# EAGLE schematic rev4.1 (EAGLE 7.5.0)

## Sheet 1 of 3
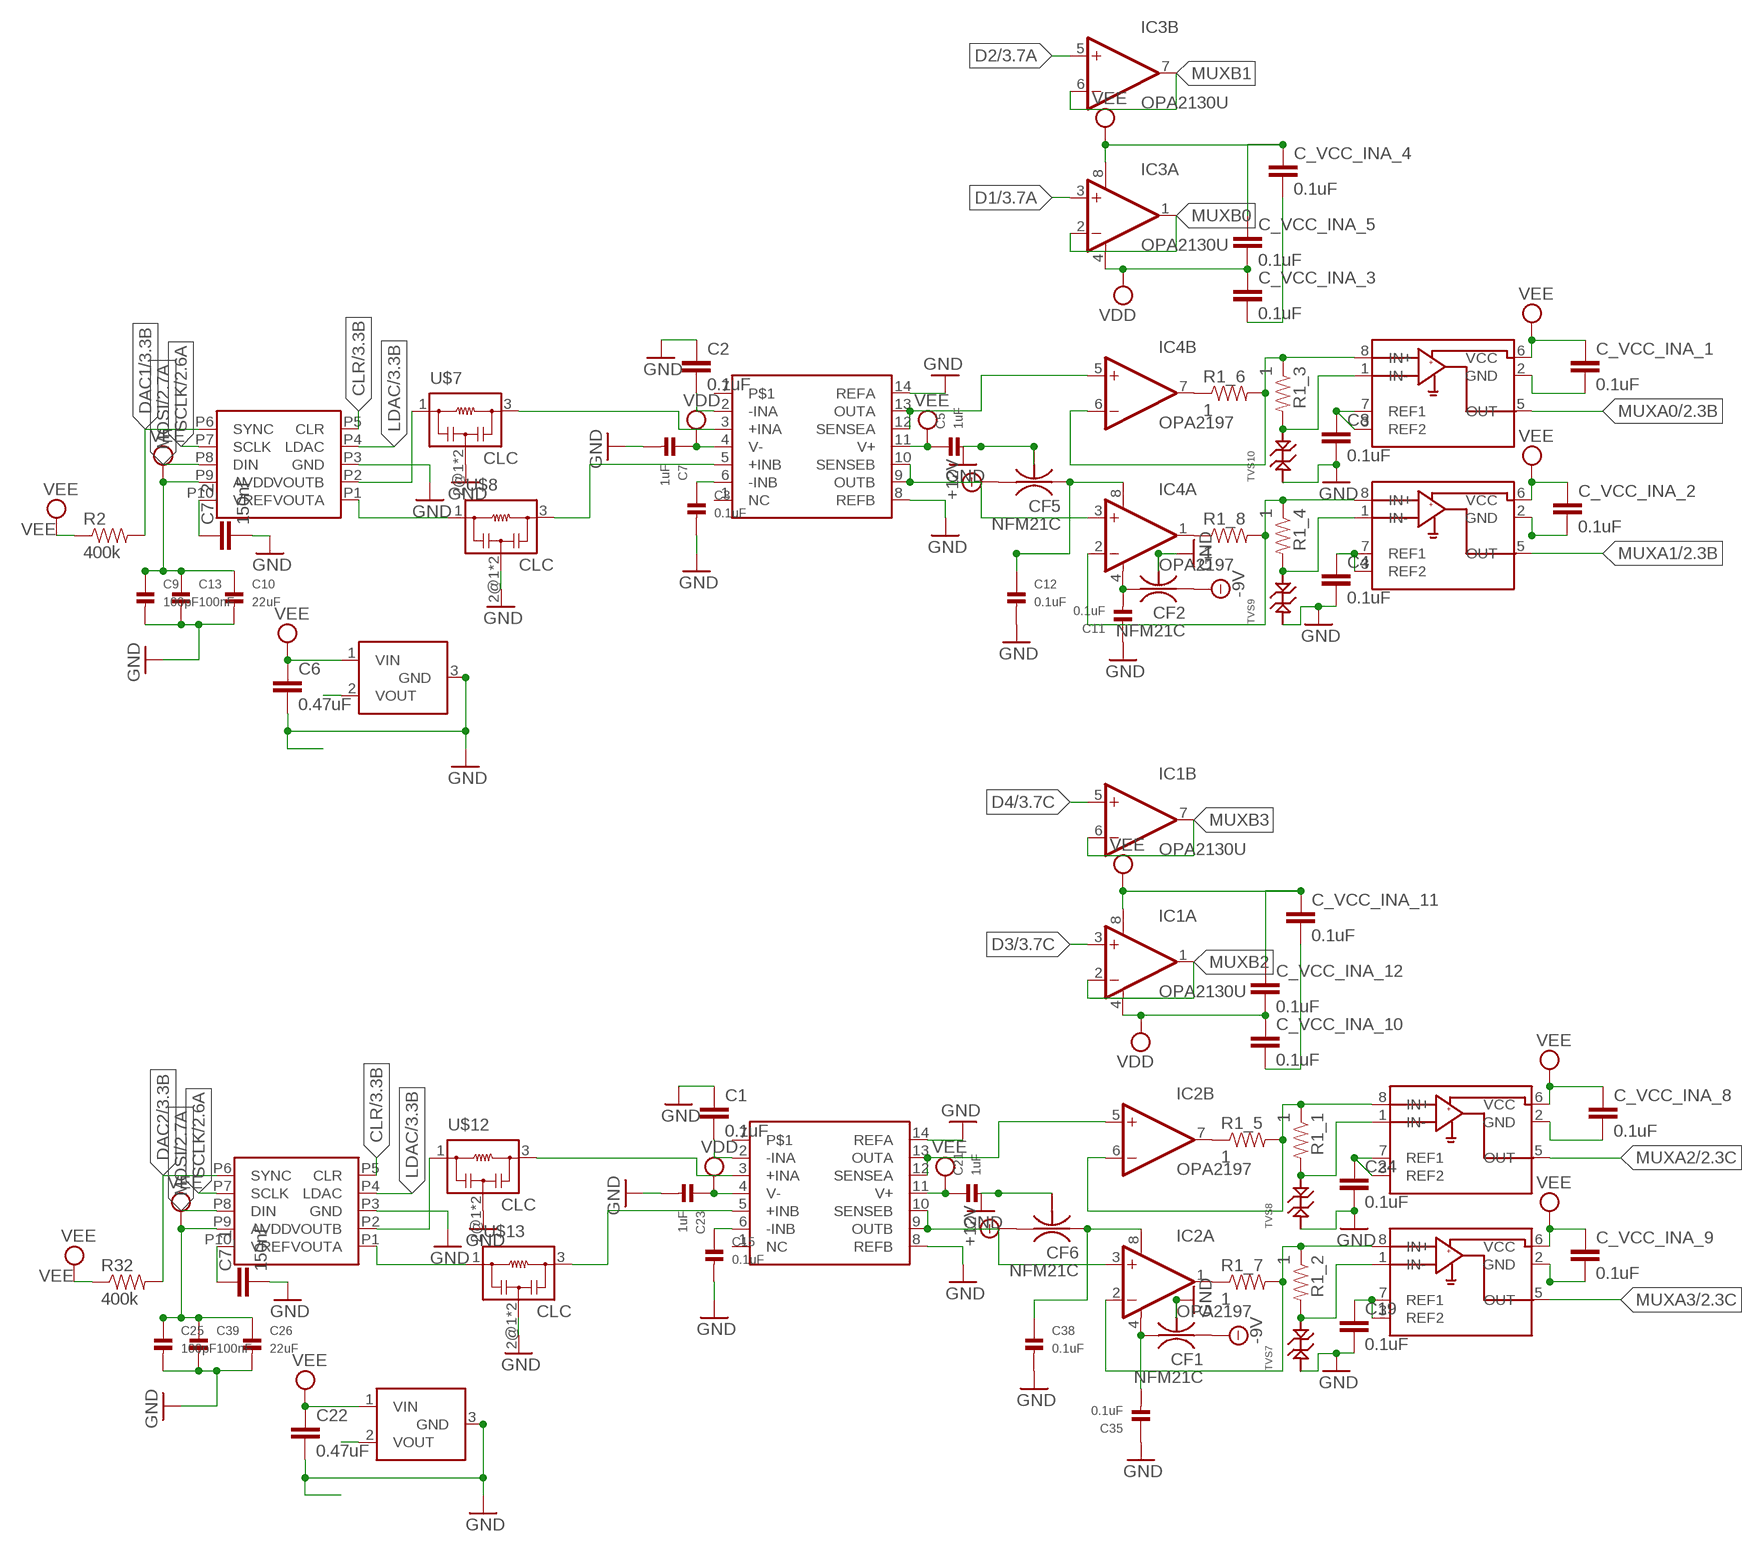
[diagram p0: schematic, sheet 1, part 1 of 2]
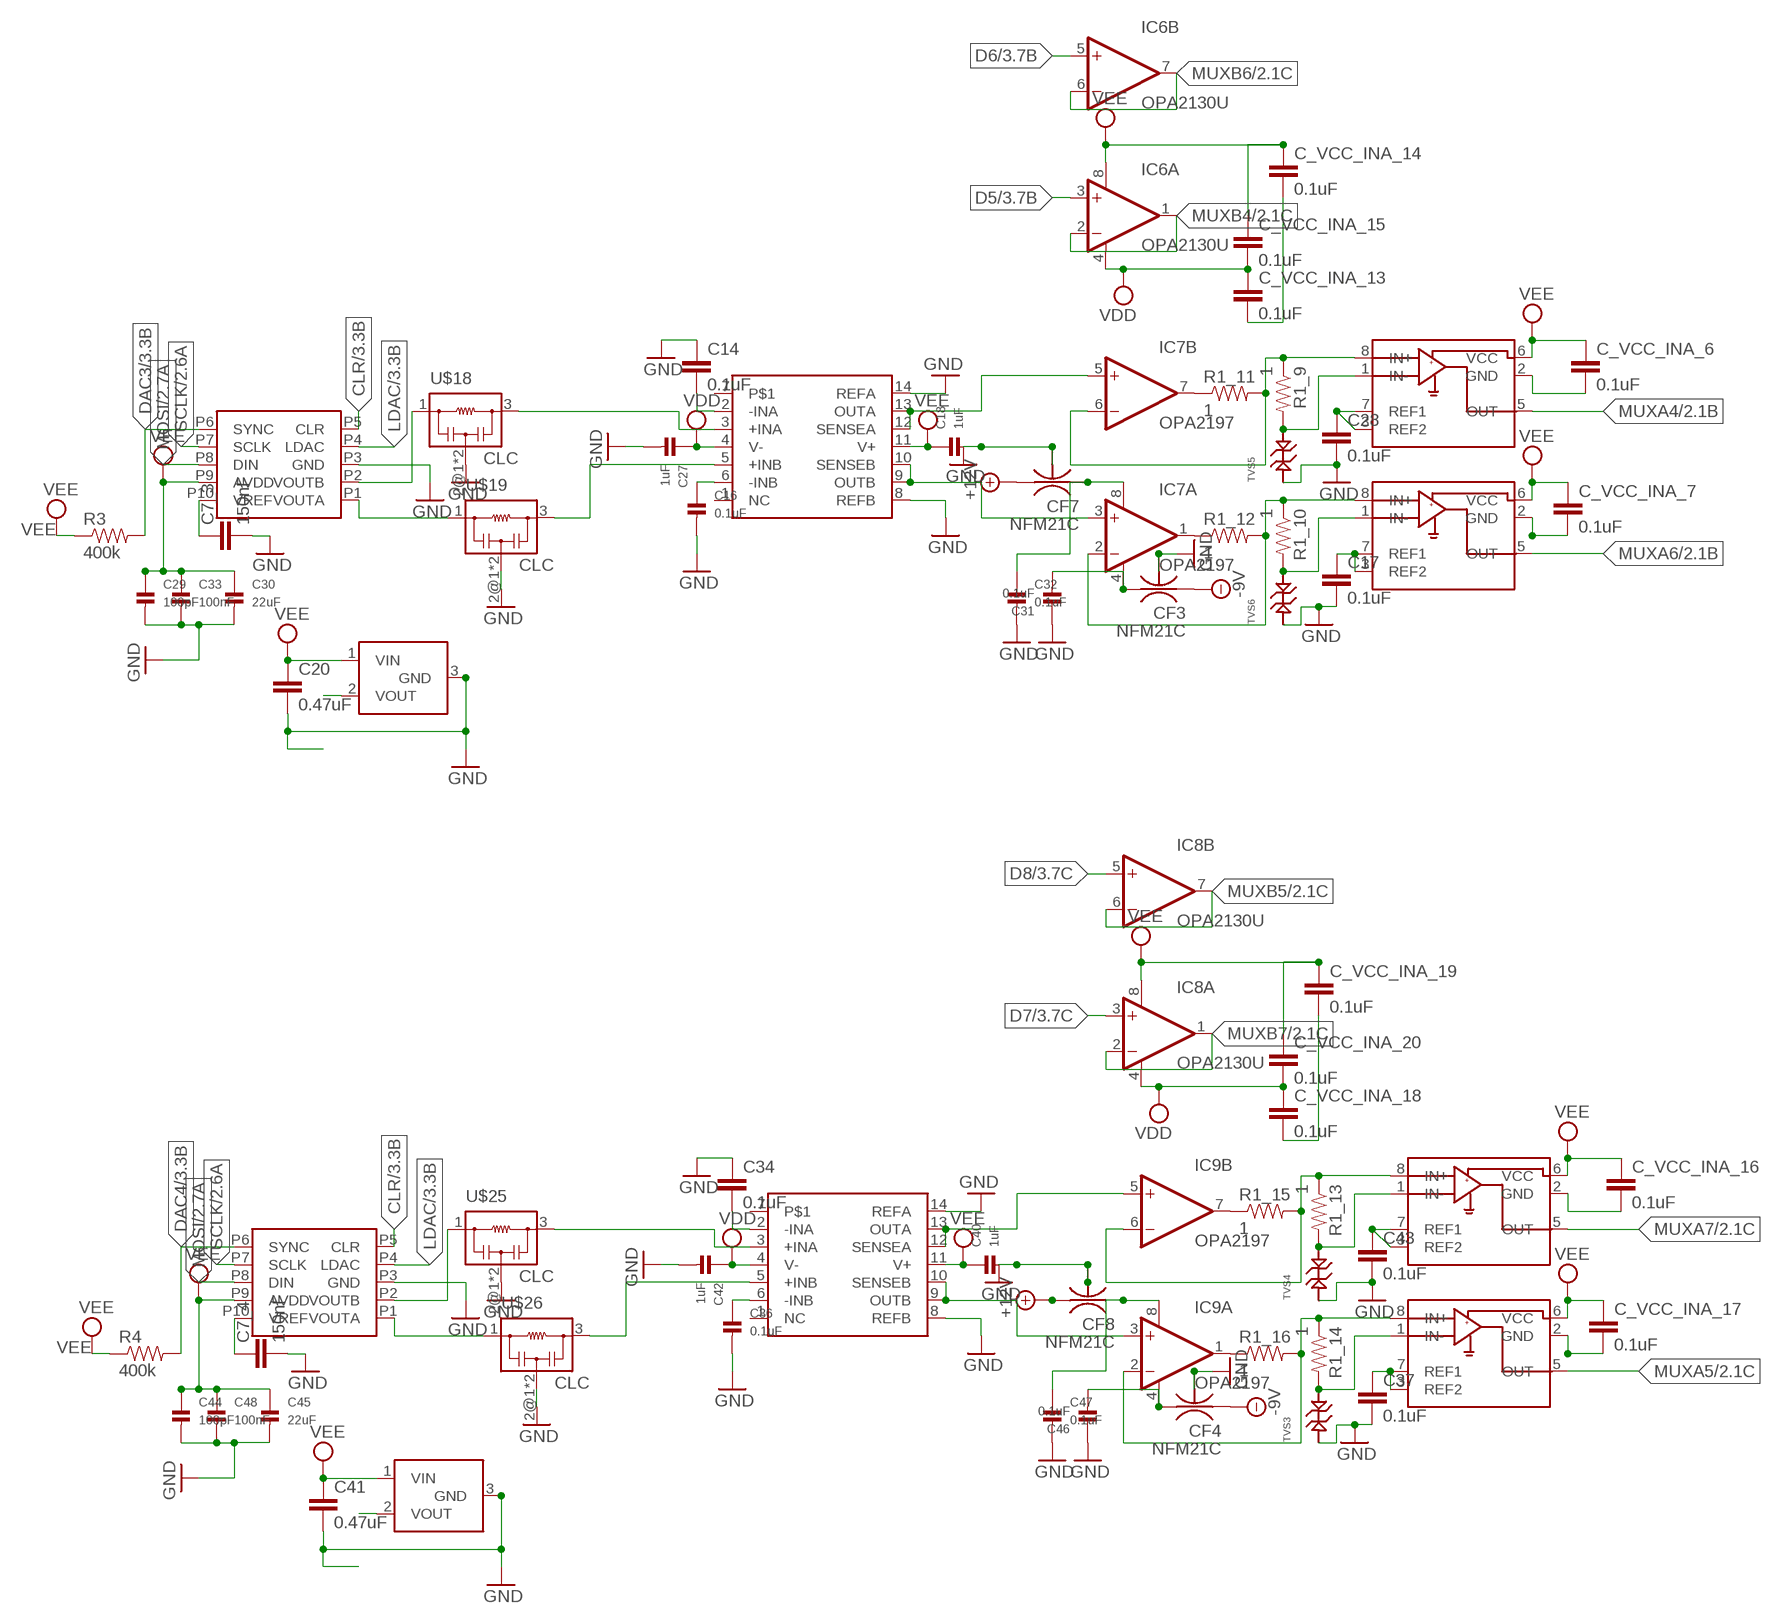
[diagram p1: schematic, sheet 1, part 2 of 2]

### Parts
C1  0.1uF  CAP0402-CAP  [0402-CAP]
C2  0.1uF  CAP0402-CAP  [0402-CAP]
C3  0.1uF  CAP_CERAMIC0402  [0402]
C4  0.1uF  CAP0402-CAP  [0402-CAP]
C5  1uF  CAP_CERAMIC0402  [0402]
C6  0.47uF  CAP0402-CAP  [0402-CAP]
C7  1uF  CAP_CERAMIC0402  [0402]
C7_1  150nF  CAP0402-CAP  [0402-CAP]
C7_2  150nF  CAP0402-CAP  [0402-CAP]
C7_3  150nF  CAP0402-CAP  [0402-CAP]
C7_4  150nF  CAP0402-CAP  [0402-CAP]
C8  0.1uF  CAP0402-CAP  [0402-CAP]
C9  100pF  CAP_CERAMIC0402  [0402]
C10  22uF  CAP_CERAMIC0805  [0805]
C11  0.1uF  CAP_CERAMIC0402  [0402]
C12  0.1uF  CAP_CERAMIC0402  [0402]
C13  100nF  CAP_CERAMIC0402  [0402]
C14  0.1uF  CAP0402-CAP  [0402-CAP]
C15  0.1uF  CAP_CERAMIC0402  [0402]
C16  0.1uF  CAP_CERAMIC0402  [0402]
C17  0.1uF  CAP0402-CAP  [0402-CAP]
C18  1uF  CAP_CERAMIC0402  [0402]
C19  0.1uF  CAP0402-CAP  [0402-CAP]
C20  0.47uF  CAP0402-CAP  [0402-CAP]
C21  1uF  CAP_CERAMIC0402  [0402]
C22  0.47uF  CAP0402-CAP  [0402-CAP]
C23  1uF  CAP_CERAMIC0402  [0402]
C24  0.1uF  CAP0402-CAP  [0402-CAP]
C25  100pF  CAP_CERAMIC0402  [0402]
C26  22uF  CAP_CERAMIC0805  [0805]
C27  1uF  CAP_CERAMIC0402  [0402]
C28  0.1uF  CAP0402-CAP  [0402-CAP]
C29  100pF  CAP_CERAMIC0402  [0402]
C30  22uF  CAP_CERAMIC0805  [0805]
C31  0.1uF  CAP_CERAMIC0402  [0402]
C32  0.1uF  CAP_CERAMIC0402  [0402]
C33  100nF  CAP_CERAMIC0402  [0402]
C34  0.1uF  CAP0402-CAP  [0402-CAP]
C35  0.1uF  CAP_CERAMIC0402  [0402]
C36  0.1uF  CAP_CERAMIC0402  [0402]
C37  0.1uF  CAP0402-CAP  [0402-CAP]
C38  0.1uF  CAP_CERAMIC0402  [0402]
C39  100nF  CAP_CERAMIC0402  [0402]
C40  1uF  CAP_CERAMIC0402  [0402]
C41  0.47uF  CAP0402-CAP  [0402-CAP]
C42  1uF  CAP_CERAMIC0402  [0402]
C43  0.1uF  CAP0402-CAP  [0402-CAP]
C44  100pF  CAP_CERAMIC0402  [0402]
C45  22uF  CAP_CERAMIC0805  [0805]
C46  0.1uF  CAP_CERAMIC0402  [0402]
C47  0.1uF  CAP_CERAMIC0402  [0402]
C48  100nF  CAP_CERAMIC0402  [0402]
C_VCC_INA_1  0.1uF  CAP0402-CAP  [0402-CAP]
C_VCC_INA_2  0.1uF  CAP0402-CAP  [0402-CAP]
C_VCC_INA_3  0.1uF  CAP0402-CAP  [0402-CAP]
C_VCC_INA_4  0.1uF  CAP0402-CAP  [0402-CAP]
C_VCC_INA_5  0.1uF  CAP0402-CAP  [0402-CAP]
C_VCC_INA_6  0.1uF  CAP0402-CAP  [0402-CAP]
C_VCC_INA_7  0.1uF  CAP0402-CAP  [0402-CAP]
C_VCC_INA_8  0.1uF  CAP0402-CAP  [0402-CAP]
C_VCC_INA_9  0.1uF  CAP0402-CAP  [0402-CAP]
C_VCC_INA_10  0.1uF  CAP0402-CAP  [0402-CAP]
C_VCC_INA_11  0.1uF  CAP0402-CAP  [0402-CAP]
C_VCC_INA_12  0.1uF  CAP0402-CAP  [0402-CAP]
C_VCC_INA_13  0.1uF  CAP0402-CAP  [0402-CAP]
C_VCC_INA_14  0.1uF  CAP0402-CAP  [0402-CAP]
C_VCC_INA_15  0.1uF  CAP0402-CAP  [0402-CAP]
C_VCC_INA_16  0.1uF  CAP0402-CAP  [0402-CAP]
C_VCC_INA_17  0.1uF  CAP0402-CAP  [0402-CAP]
C_VCC_INA_18  0.1uF  CAP0402-CAP  [0402-CAP]
C_VCC_INA_19  0.1uF  CAP0402-CAP  [0402-CAP]
C_VCC_INA_20  0.1uF  CAP0402-CAP  [0402-CAP]
CF1  NFM21C  [NFM21C]
CF2  NFM21C  [NFM21C]
CF3  NFM21C  [NFM21C]
CF4  NFM21C  [NFM21C]
CF5  NFM21C  [NFM21C]
CF6  NFM21C  [NFM21C]
CF7  NFM21C  [NFM21C]
CF8  NFM21C  [NFM21C]
IC1  OPA2130U  [SO08]
IC2  OPA2197  OPA2130U  [SO08]
IC3  OPA2130U  [SO08]
IC4  OPA2197  OPA2130U  [SO08]
IC6  OPA2130U  [SO08]
IC7  OPA2197  OPA2130U  [SO08]
IC8  OPA2130U  [SO08]
IC9  OPA2197  OPA2130U  [SO08]
R1_1  1  RESISTOR0603-RES  [0603-RES]
R1_2  1  RESISTOR0603-RES  [0603-RES]
R1_3  1  RESISTOR0603-RES  [0603-RES]
R1_4  1  RESISTOR0603-RES  [0603-RES]
R1_5  1  RESISTOR0603-RES  [0603-RES]
R1_6  1  RESISTOR0603-RES  [0603-RES]
R1_7  1  RESISTOR0603-RES  [0603-RES]
R1_8  1  RESISTOR0603-RES  [0603-RES]
R1_9  1  RESISTOR0603-RES  [0603-RES]
R1_10  1  RESISTOR0603-RES  [0603-RES]
R1_11  1  RESISTOR0603-RES  [0603-RES]
R1_12  1  RESISTOR0603-RES  [0603-RES]
R1_13  1  RESISTOR0603-RES  [0603-RES]
R1_14  1  RESISTOR0603-RES  [0603-RES]
R1_15  1  RESISTOR0603-RES  [0603-RES]
R1_16  1  RESISTOR0603-RES  [0603-RES]
R2  400k  0.27OHM-1/10W-1%(0603)  [0603-RES]
R3  400k  0.27OHM-1/10W-1%(0603)  [0603-RES]
R4  400k  0.27OHM-1/10W-1%(0603)  [0603-RES]
R32  400k  0.27OHM-1/10W-1%(0603)  [0603-RES]
REF1  REF3040  REF3020  [DBZ_R-PDSO-G3]
REF2  REF3040  REF3020  [DBZ_R-PDSO-G3]
REF3  REF3040  REF3020  [DBZ_R-PDSO-G3]
REF4  REF3040  REF3020  [DBZ_R-PDSO-G3]
TVS3  TVS_DIODE_SOD-923  [SOD-923]
TVS4  TVS_DIODE_SOD-923  [SOD-923]
TVS5  TVS_DIODE_SOD-923  [SOD-923]
TVS6  TVS_DIODE_SOD-923  [SOD-923]
TVS7  TVS_DIODE_SOD-923  [SOD-923]
TVS8  TVS_DIODE_SOD-923  [SOD-923]
TVS9  TVS_DIODE_SOD-923  [SOD-923]
TVS10  TVS_DIODE_SOD-923  [SOD-923]
U$1  INA283  INA285PDSO-G8  [S-PDSO-G08-NOTHERMALPAD]
U$2  INA283  INA285PDSO-G8  [S-PDSO-G08-NOTHERMALPAD]
U$3  INA2132  INA2132REALONE  [SO-14]
U$4  DAC7563  [S-PDSO-G10]
U$5  INA283  INA285PDSO-G8  [S-PDSO-G08-NOTHERMALPAD]
U$7  CLC  [NFM21C]
U$8  CLC  [NFM21C]
U$9  INA283  INA285PDSO-G8  [S-PDSO-G08-NOTHERMALPAD]
U$10  INA2132  INA2132REALONE  [SO-14]
U$11  DAC7563  [S-PDSO-G10]
U$12  CLC  [NFM21C]
U$13  CLC  [NFM21C]
U$14  INA283  INA285PDSO-G8  [S-PDSO-G08-NOTHERMALPAD]
U$15  INA283  INA285PDSO-G8  [S-PDSO-G08-NOTHERMALPAD]
U$16  INA2132  INA2132REALONE  [SO-14]
U$17  DAC7563  [S-PDSO-G10]
U$18  CLC  [NFM21C]
U$19  CLC  [NFM21C]
U$20  INA283  INA285PDSO-G8  [S-PDSO-G08-NOTHERMALPAD]
U$21  INA283  INA285PDSO-G8  [S-PDSO-G08-NOTHERMALPAD]
U$23  INA2132  INA2132REALONE  [SO-14]
U$24  DAC7563  [S-PDSO-G10]
U$25  CLC  [NFM21C]
U$26  CLC  [NFM21C]

### Nets
+12V: CF5.3 CF6.3 CF7.3 CF8.3 ; also sheet 2,3
-9V: CF1.1 CF2.1 CF3.1 CF4.1 ; also sheet 2,3
CLR: U$4.P5(CLR) U$11.P5(CLR) U$17.P5(CLR) U$24.P5(CLR) ; also sheet 3
D1: IC3.3(A:+IN) R1_3.2 TVS10.P$2 U$1.1(IN-) ; also sheet 3
D2: IC3.5(B:+IN) R1_4.2 TVS9.P$2 U$2.1(IN-) ; also sheet 3
D3: IC1.3(A:+IN) R1_1.2 TVS8.P$2 U$5.1(IN-) ; also sheet 3
D4: IC1.5(B:+IN) R1_2.2 TVS7.P$2 U$9.1(IN-) ; also sheet 3
D5: IC6.3(A:+IN) R1_9.2 TVS5.P$2 U$14.1(IN-) ; also sheet 3
D6: IC6.5(B:+IN) R1_10.2 TVS6.P$2 U$15.1(IN-) ; also sheet 3
D7: IC8.3(A:+IN) R1_13.2 TVS4.P$2 U$20.1(IN-) ; also sheet 3
D8: IC8.5(B:+IN) R1_14.2 TVS3.P$2 U$21.1(IN-) ; also sheet 3
DAC1: R2.2 U$4.P6(SYNC) ; also sheet 3
DAC2: R32.2 U$11.P6(SYNC) ; also sheet 3
DAC3: R3.2 U$17.P6(SYNC) ; also sheet 3
DAC4: R4.2 U$24.P6(SYNC) ; also sheet 3
DACOUTA1: U$4.P1(VOUTA) U$8.1
DACOUTA2: U$11.P1(VOUTA) U$13.1
DACOUTA3: U$17.P1(VOUTA) U$19.1
DACOUTA4: U$24.P1(VOUTA) U$26.1
DACOUTAFIL1: U$3.5(+INB) U$8.3
DACOUTAFIL2: U$10.5(+INB) U$13.3
DACOUTAFIL3: U$16.5(+INB) U$19.3
DACOUTAFIL4: U$23.5(+INB) U$26.3
DACOUTB1: U$4.P2(VOUTB) U$7.1
DACOUTB2: U$11.P2(VOUTB) U$12.1
DACOUTB3: U$17.P2(VOUTB) U$18.1
DACOUTB4: U$24.P2(VOUTB) U$25.1
DACOUTBFIL1: U$3.3(+INA) U$7.3
DACOUTBFIL2: U$10.3(+INA) U$12.3
DACOUTBFIL3: U$16.3(+INA) U$18.3
DACOUTBFIL4: U$23.3(+INA) U$25.3
GND: C1.1 C2.1 C3.2 C4.2 C5.2 C6.2 C7.2 C7_1.2 C7_2.2 C7_3.2 C7_4.2 C8.2 C9.2 C10.2 C11.1 C12.2 C13.2 C14.1 C15.2 C16.2 C17.2 C18.2 C19.2 C20.2 C21.2 C22.2 C23.2 C24.2 C25.2 C26.2 C27.2 C28.2 C29.2 C30.2 C31.1 C32.2 C33.2 C34.1 C35.1 C36.2 C37.2 C38.2 C39.2 C40.2 C41.2 C42.2 C43.2 C44.2 C45.2 C46.1 C47.2 C48.2 C_VCC_INA_1.2 C_VCC_INA_2.2 C_VCC_INA_3.2 C_VCC_INA_4.2 C_VCC_INA_6.2 C_VCC_INA_7.2 C_VCC_INA_8.2 C_VCC_INA_9.2 C_VCC_INA_10.2 C_VCC_INA_11.2 C_VCC_INA_13.2 C_VCC_INA_14.2 C_VCC_INA_16.2 C_VCC_INA_17.2 C_VCC_INA_18.2 C_VCC_INA_19.2 CF1.2@1 CF1.2@2 CF2.2@1 CF2.2@2 CF3.2@1 CF3.2@2 CF4.2@1 CF4.2@2 CF5.2@1 CF5.2@2 CF6.2@1 CF7.2@1 CF7.2@2 CF8.2@1 CF8.2@2 REF1.3(GND) REF2.3(GND) REF3.3(GND) REF4.3(GND) TVS3.P$1 TVS4.P$1 TVS5.P$1 TVS6.P$1 TVS7.P$1 TVS8.P$1 TVS9.P$1 TVS10.P$1 U$1.2(GND) U$2.2(GND) U$3.8(REFB) U$3.14(REFA) U$4.P3(GND) U$5.2(GND) U$7.2@1 U$7.2@2 U$8.2@1 U$8.2@2 U$9.2(GND) U$10.8(REFB) U$10.14(REFA) U$11.P3(GND) U$12.2@1 U$12.2@2 U$13.2@1 U$13.2@2 U$14.2(GND) U$15.2(GND) U$16.8(REFB) U$16.14(REFA) U$17.P3(GND) U$18.2@1 U$18.2@2 U$19.2@1 U$19.2@2 U$20.2(GND) U$21.2(GND) U$23.8(REFB) U$23.14(REFA) U$24.P3(GND) U$25.2@1 U$25.2@2 U$26.2@1 U$26.2@2 ; also sheet 2,3
LDAC: U$4.P4(LDAC) U$11.P4(LDAC) U$17.P4(LDAC) U$24.P4(LDAC) ; also sheet 3
MOSI: U$4.P8(DIN) U$11.P8(DIN) U$17.P8(DIN) U$24.P8(DIN) ; also sheet 2,3
MUXA0: U$1.5(OUT) ; also sheet 2
MUXA1: U$2.5(OUT) ; also sheet 2
MUXA2: U$5.5(OUT) ; also sheet 2
MUXA3: U$9.5(OUT) ; also sheet 2
MUXA4: U$14.5(OUT) ; also sheet 2
MUXA5: U$21.5(OUT) ; also sheet 2
MUXA6: U$15.5(OUT) ; also sheet 2
MUXA7: U$20.5(OUT) ; also sheet 2
MUXB0: IC3.1(A:OUT) IC3.2(A:-IN) ; also sheet 2
MUXB1: IC3.6(B:-IN) IC3.7(B:OUT) ; also sheet 2
MUXB2: IC1.1(A:OUT) IC1.2(A:-IN) ; also sheet 2
MUXB3: IC1.6(B:-IN) IC1.7(B:OUT) ; also sheet 2
MUXB4: IC6.1(A:OUT) IC6.2(A:-IN) ; also sheet 2
MUXB5: IC8.6(B:-IN) IC8.7(B:OUT) ; also sheet 2
MUXB6: IC6.6(B:-IN) IC6.7(B:OUT) ; also sheet 2
MUXB7: IC8.1(A:OUT) IC8.2(A:-IN) ; also sheet 2
N$1: IC2.5(B:+IN) U$10.12(SENSEA) U$10.13(OUTA)
N$2: IC4.5(B:+IN) U$3.12(SENSEA) U$3.13(OUTA)
N$3: IC4.3(A:+IN) U$3.9(OUTB) U$3.10(SENSEB)
N$5: IC2.7(B:OUT) R1_5.1
N$7: IC4.7(B:OUT) R1_6.1
N$8: IC4.2(A:-IN) R1_4.1 R1_8.2 U$2.8(IN+)
N$13: IC2.2(A:-IN) R1_2.1 R1_7.2 U$9.8(IN+)
N$14: IC2.1(A:OUT) R1_7.1
N$15: IC4.1(A:OUT) R1_8.1
N$16: IC2.3(A:+IN) U$10.9(OUTB) U$10.10(SENSEB)
N$18: IC7.5(B:+IN) U$16.12(SENSEA) U$16.13(OUTA)
N$19: IC7.3(A:+IN) U$16.9(OUTB) U$16.10(SENSEB)
N$21: IC7.7(B:OUT) R1_11.1
N$22: IC7.2(A:-IN) R1_10.1 R1_12.2 U$15.8(IN+)
N$25: IC7.1(A:OUT) R1_12.1
N$26: IC9.5(B:+IN) U$23.12(SENSEA) U$23.13(OUTA)
N$27: IC9.3(A:+IN) U$23.9(OUTB) U$23.10(SENSEB)
N$28: IC9.7(B:OUT) R1_15.1
N$29: IC9.2(A:-IN) R1_14.1 R1_16.2 U$21.8(IN+)
N$31: IC9.1(A:OUT) R1_16.1
N$33: C11.2 CF2.3 IC4.4(A:V-)
N$37: C38.1 CF6.1 IC2.8(A:V+)
N$38: C35.2 CF1.3 IC2.4(A:V-)
N$39: C31.2 CF3.3 IC7.4(A:V-)
N$40: C46.2 CF4.3 IC9.4(A:V-)
N$41: C12.1 CF5.1 IC4.8(A:V+)
N$42: C47.1 CF8.1 IC9.8(A:V+)
N$44: C32.1 CF7.1 IC7.8(A:V+)
OUT1: IC4.6(B:-IN) R1_3.1 R1_6.2 U$1.8(IN+)
OUT2: IC7.6(B:-IN) R1_9.1 R1_11.2 U$14.8(IN+)
OUT3: IC9.6(B:-IN) R1_13.1 R1_15.2 U$20.8(IN+)
OUT4: IC2.6(B:-IN) R1_1.1 R1_5.2 U$5.8(IN+)
REF2: C1.2 C2.2 C3.1 C4.1 C8.1 C14.2 C15.1 C16.1 C17.1 C19.1 C24.1 C28.1 C34.2 C36.1 C37.1 C43.1 U$1.3(REF2) U$1.7(REF1) U$2.3(REF2) U$2.7(REF1) U$3.2(-INA) U$3.6(-INB) U$5.3(REF2) U$5.7(REF1) U$9.3(REF2) U$9.7(REF1) U$10.2(-INA) U$10.6(-INB) U$14.3(REF2) U$14.7(REF1) U$15.3(REF2) U$15.7(REF1) U$16.2(-INA) U$16.6(-INB) U$20.3(REF2) U$20.7(REF1) U$21.3(REF2) U$21.7(REF1) U$23.2(-INA) U$23.6(-INB) ; also sheet 2
REF3: C7_1.1 REF1.2(VOUT) U$11.P10(VREF)
REF4: C7_2.1 REF2.2(VOUT) U$4.P10(VREF)
REF6: C7_3.1 REF3.2(VOUT) U$17.P10(VREF)
REF8: C7_4.1 REF4.2(VOUT) U$24.P10(VREF)
SCLK: U$4.P7(SCLK) U$11.P7(SCLK) U$17.P7(SCLK) U$24.P7(SCLK) ; also sheet 2,3
VDD: C7.1 C23.1 C27.1 C42.1 C_VCC_INA_3.1 C_VCC_INA_5.2 C_VCC_INA_10.1 C_VCC_INA_12.2 C_VCC_INA_13.1 C_VCC_INA_15.2 C_VCC_INA_18.1 C_VCC_INA_20.2 IC1.4(A:V-) IC3.4(A:V-) IC6.4(A:V-) IC8.4(A:V-) U$3.4(V-) U$10.4(V-) U$16.4(V-) U$23.4(V-) ; also sheet 2
VEE: C5.1 C6.1 C9.1 C10.1 C13.1 C18.1 C20.1 C21.1 C22.1 C25.1 C26.1 C29.1 C30.1 C33.1 C39.1 C40.1 C41.1 C44.1 C45.1 C48.1 C_VCC_INA_1.1 C_VCC_INA_2.1 C_VCC_INA_4.1 C_VCC_INA_5.1 C_VCC_INA_6.1 C_VCC_INA_7.1 C_VCC_INA_8.1 C_VCC_INA_9.1 C_VCC_INA_11.1 C_VCC_INA_12.1 C_VCC_INA_14.1 C_VCC_INA_15.1 C_VCC_INA_16.1 C_VCC_INA_17.1 C_VCC_INA_19.1 C_VCC_INA_20.1 IC1.8(A:V+) IC3.8(A:V+) IC6.8(A:V+) IC8.8(A:V+) R2.1 R3.1 R4.1 R32.1 REF1.1(VIN) REF2.1(VIN) REF3.1(VIN) REF4.1(VIN) U$1.6(VCC) U$2.6(VCC) U$3.11(V+) U$4.P9(AVDD) U$5.6(VCC) U$9.6(VCC) U$10.11(V+) U$11.P9(AVDD) U$14.6(VCC) U$15.6(VCC) U$16.11(V+) U$17.P9(AVDD) U$20.6(VCC) U$21.6(VCC) U$23.11(V+) U$24.P9(AVDD) ; also sheet 2
Unconnected: CF6.2@2 U$3.1(NC) U$3.7 U$10.1(NC) U$10.7 U$16.1(NC) U$16.7 U$23.1(NC) U$23.7

## Sheet 2 of 3
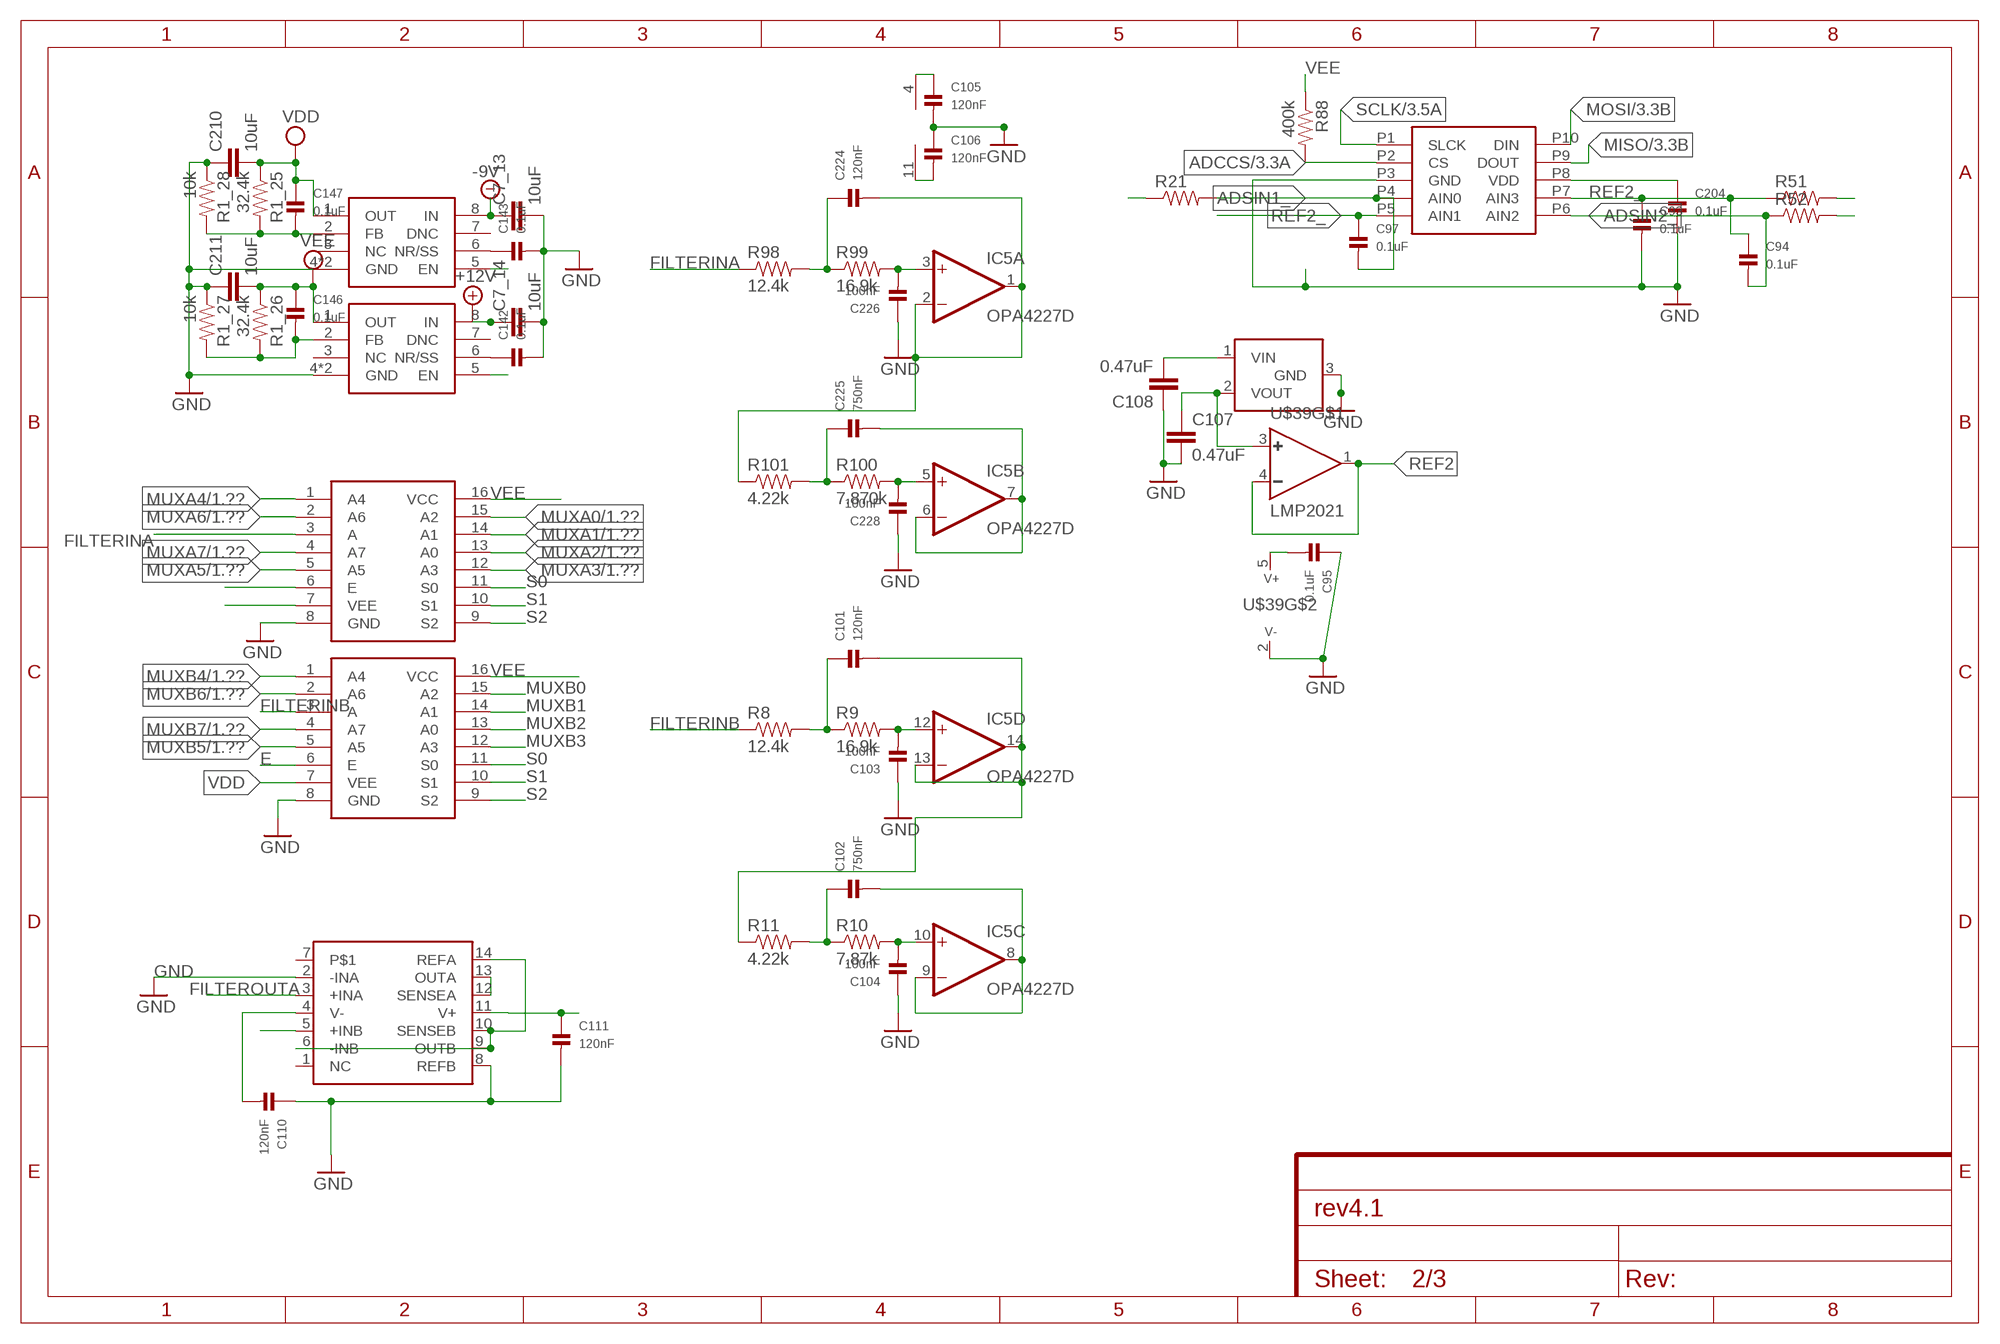
[diagram p2: schematic, sheet 2]
ADLINE (FRAME-A4L): CNAME: A/D; CREVISION: 4.0; DESIGNER: Norman Pellet

### Parts
C7_13  10uF  CAP0805  [0805]
C7_14  10uF  CAP0805  [0805]
C93  0.1uF  CAP_CERAMIC0402  [0402]
C94  0.1uF  CAP_CERAMIC0402  [0402]
C95  0.1uF  CAP_CERAMIC0402  [0402]
C97  0.1uF  CAP_CERAMIC0402  [0402]
C101  120nF  CAP_CERAMIC0402  [0402]
C102  750nF  CAP_CERAMIC0402  [0402]
C103  100nF  CAP_CERAMIC0402  [0402]
C104  100nF  CAP_CERAMIC0402  [0402]
C105  120nF  CAP_CERAMIC0402  [0402]
C106  120nF  CAP_CERAMIC0402  [0402]
C107  0.47uF  CAP0402-CAP  [0402-CAP]
C108  0.47uF  CAP0402-CAP  [0402-CAP]
C110  120nF  CAP_CERAMIC0402  [0402]
C111  120nF  CAP_CERAMIC0402  [0402]
C142  0.1uF  CAP_CERAMIC0402  [0402]
C143  0.1uF  CAP_CERAMIC0402  [0402]
C146  0.1uF  CAP_CERAMIC0402  [0402]
C147  0.1uF  CAP_CERAMIC0402  [0402]
C204  0.1uF  CAP_CERAMIC0402  [0402]
C210  10uF  CAP0805  [0805]
C211  10uF  CAP0805  [0805]
C224  120nF  CAP_CERAMIC0402  [0402]
C225  750nF  CAP_CERAMIC0402  [0402]
C226  100nF  CAP_CERAMIC0402  [0402]
C228  100nF  CAP_CERAMIC0402  [0402]
IC5  OPA4227D  [SO14]
R1_25  32.4k  RESISTOR0603-RES  [0603-RES]
R1_26  32.4k  RESISTOR0603-RES  [0603-RES]
R1_27  10k  RESISTOR0603-RES  [0603-RES]
R1_28  10k  RESISTOR0603-RES  [0603-RES]
R8  12.4k  RESISTOR0603-RES  [0603-RES]
R9  16.9k  RESISTOR0603-RES  [0603-RES]
R10  7.87k  RESISTOR0603-RES  [0603-RES]
R11  4.22k  RESISTOR0603-RES  [0603-RES]
R21  RESISTOR0603-RES  [0603-RES]
R51  RESISTOR0603-RES  [0603-RES]
R52  RESISTOR0603-RES  [0603-RES]
R88  400k  0.27OHM-1/10W-1%(0603)  [0603-RES]
R98  12.4k  RESISTOR0603-RES  [0603-RES]
R99  16.9k  RESISTOR0603-RES  [0603-RES]
R100  7.870k  RESISTOR0603-RES  [0603-RES]
R101  4.22k  RESISTOR0603-RES  [0603-RES]
REF7  REF3020  [DBZ_R-PDSO-G3]
U$6  CD54HC4051  [PW_R-PDSO-G16]
U$39  LMP2021  [SOT23-DBV]
U$40  ADS1018  [S-PDSO-G10]
U$48  TPS7A30  [S-PDSO-G08]
U$49  TPS7A30  [S-PDSO-G08]
U$57  CD54HC4051  [PW_R-PDSO-G16]
U$58  INA2132  INA2132REALONE  [SO-14]

### Nets
+12V: C7_14.1 U$49.8(IN) ; also sheet 1,3
-9V: C7_13.1 U$48.8(IN) ; also sheet 1,3
ADCCS: R88.2 U$40.P2(CS) ; also sheet 3
ADSIN1: C102.2 IC5.8(C:OUT) IC5.9(C:-IN) R21.1
ADSIN1_: C97.2 R21.2 U$40.P4(AIN0)
ADSIN2: R52.2 U$58.12(SENSEA) U$58.13(OUTA)
ADSIN2_: C94.2 R52.1 U$40.P6(AIN2)
E: U$6.6(E) U$57.6(E) ; also sheet 3
EN: U$48.5(EN) U$49.5(EN) ; also sheet 3
FILTERINA: R98.1 U$6.3(A)
FILTERINB: R8.1 U$57.3(A)
FILTEROUTA: C225.2 IC5.6(B:-IN) IC5.7(B:OUT) U$58.3(+INA)
GND: C7_13.2 C7_14.2 C93.2 C95.1 C103.1 C104.1 C105.2 C106.1 C107.2 C108.1 C110.1 C111.2 C142.2 C143.2 C204.2 C210.1 C211.1 C226.1 C228.1 R1_27.1 R1_28.1 REF7.3(GND) U$6.8(GND) U$39.2(V-) U$40.P3(GND) U$48.4(GND) U$48.TH(GND) U$49.4(GND) U$49.TH(GND) U$57.8(GND) U$58.2(-INA) U$58.8(REFB) ; also sheet 1,3
MISO: U$40.P9(DOUT) ; also sheet 3
MOSI: U$40.P10(DIN) ; also sheet 1,3
MUXA0: U$6.15(A2) ; also sheet 1
MUXA1: U$6.14(A1) ; also sheet 1
MUXA2: U$6.13(A0) ; also sheet 1
MUXA3: U$6.12(A3) ; also sheet 1
MUXA4: U$6.1(A4) ; also sheet 1
MUXA5: U$6.5(A5) ; also sheet 1
MUXA6: U$6.2(A6) ; also sheet 1
MUXA7: U$6.4(A7) ; also sheet 1
MUXB0: U$57.15(A2) ; also sheet 1
MUXB1: U$57.14(A1) ; also sheet 1
MUXB2: U$57.13(A0) ; also sheet 1
MUXB3: U$57.12(A3) ; also sheet 1
MUXB4: U$57.1(A4) ; also sheet 1
MUXB5: U$57.5(A5) ; also sheet 1
MUXB6: U$57.2(A6) ; also sheet 1
MUXB7: U$57.4(A7) ; also sheet 1
N$17: C107.1 REF7.2(VOUT) U$39.3(+)
N$56: C101.2 IC5.13(D:-IN) IC5.14(D:OUT) R11.1
N$57: C103.2 IC5.12(D:+IN) R9.2
N$58: C104.2 IC5.10(C:+IN) R10.2
N$59: C102.1 R10.1 R11.2
N$61: U$58.6(-INB) U$58.9(OUTB) U$58.10(SENSEB) U$58.14(REFA)
N$62: C101.1 R8.2 R9.1
N$128: C143.1 U$48.6(NR/SS)
N$129: C142.1 U$49.6(NR/SS)
N$130: C146.2 R1_26.2 R1_27.2 U$49.2(FB)
N$131: C147.2 R1_25.2 R1_28.2 U$48.2(FB)
N$134: C226.2 IC5.3(A:+IN) R99.2
N$142: C228.2 IC5.5(B:+IN) R100.2
N$143: C225.1 R100.1 R101.2
N$146: C224.2 IC5.1(A:OUT) IC5.2(A:-IN) R101.1
N$149: C224.1 R98.2 R99.1
REF2: R51.2 U$39.1(OUT) U$39.4(-) U$58.5(+INB) ; also sheet 1
REF2_: C93.1 C94.1 C97.1 R51.1 U$40.P5(AIN1) U$40.P7(AIN3)
S0: U$6.11(S0) U$57.11(S0) ; also sheet 3
S1: U$6.10(S1) U$57.10(S1) ; also sheet 3
S2: U$6.9(S2) U$57.9(S2) ; also sheet 3
SCLK: U$40.P1(SLCK) ; also sheet 1,3
VDD: C106.2 C111.1 C147.1 C210.2 IC5.11(P:V-) R1_25.1 U$6.7(VEE) U$48.1(OUT) U$57.7(VEE) U$58.11(V+) ; also sheet 1
VEE: C95.2 C105.1 C108.2 C110.2 C146.1 C204.1 C211.2 IC5.4(P:V+) R1_26.1 R88.1 REF7.1(VIN) U$6.16(VCC) U$39.5(V+) U$40.P8(VDD) U$49.1(OUT) U$57.16(VCC) U$58.4(V-) ; also sheet 1
Unconnected: U$48.3(NC) U$48.7(DNC) U$49.3(NC) U$49.7(DNC) U$58.1(NC) U$58.7

## Sheet 3 of 3
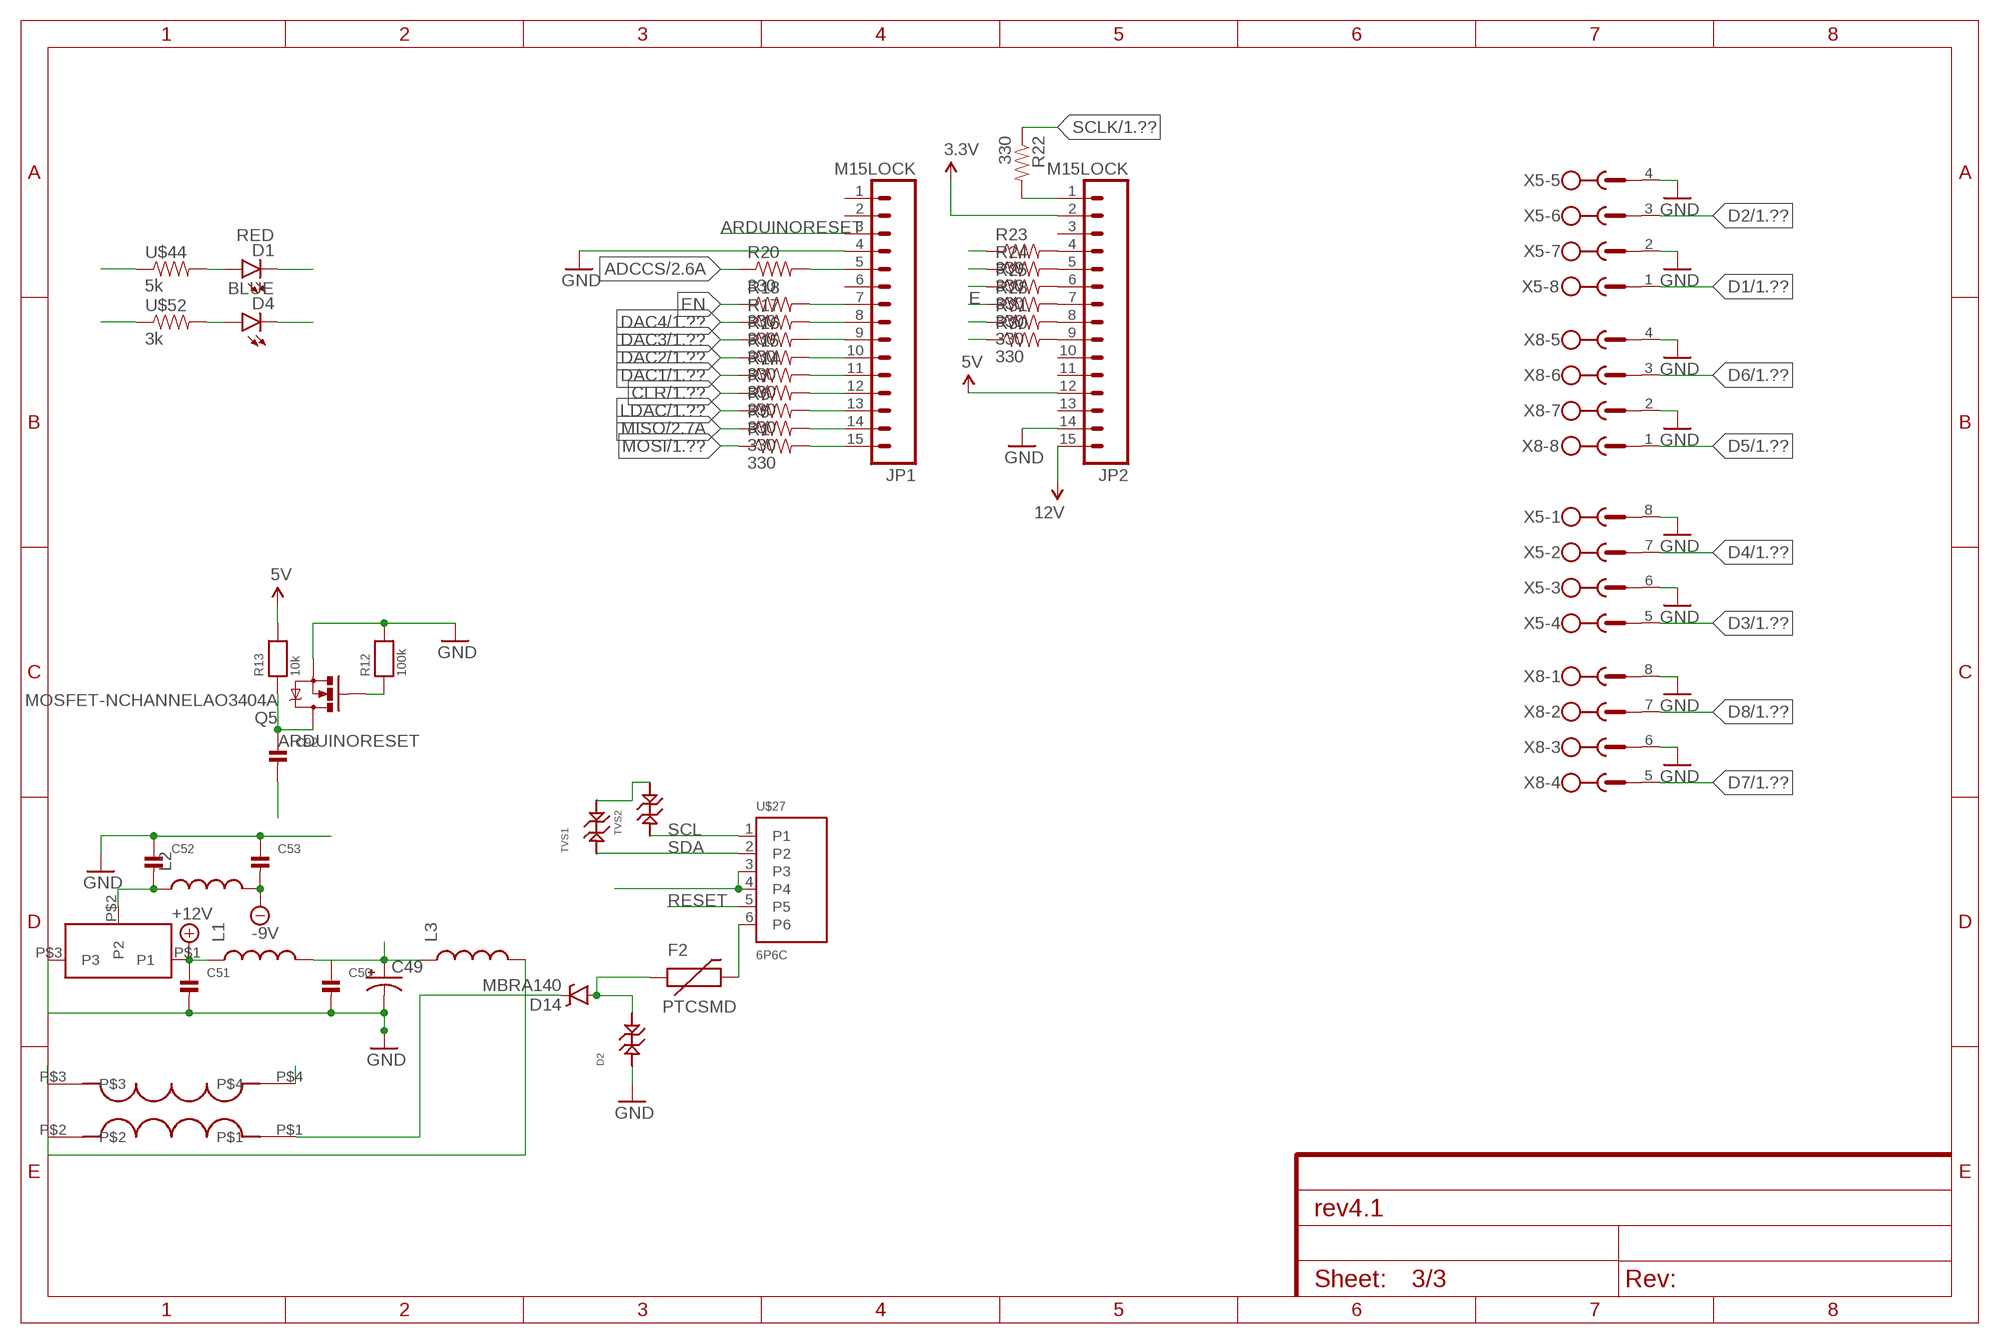
[diagram p3: schematic, sheet 3]

### Parts
C49  CAP_POLH13  [PANASONIC_H13]
C50  CAP_CERAMIC1206  [1206]
C51  CAP_CERAMIC1206  [1206]
C52  CAP_CERAMIC1206  [1206]
C53  CAP_CERAMIC1206  [1206]
C92  CAP_CERAMIC0402  [0402]
D1  RED  LED-RED1206  [LED-1206]
D2  TVS_DIODE_SOD-923  [SOD-923]
D4  BLUE  LED-RED1206  [LED-1206]
D14  MBRA140  DIODE-SCHOTTKY-MBRA140  [SMA-DIODE]
F2  PTCSMD  [PTC-1206]
JP1  M15LOCK  [1X15_LOCK]
JP2  M15LOCK  [1X15_LOCK]
L1  INDUCTORINDUCTOR_12MM_BOURNS  [INDUCTOR-12MM_BOURNS]
L2  INDUCTORINDUCTOR_12MM_BOURNS  [INDUCTOR-12MM_BOURNS]
L3  INDUCTORINDUCTOR_12MM_BOURNS  [INDUCTOR-12MM_BOURNS]
Q5  MOSFET-NCHANNELAO3404A  [SOT23-3]
R1  330  RESISTOR0603-RES  [0603-RES]
R5  330  RESISTOR0603-RES  [0603-RES]
R6  330  RESISTOR0603-RES  [0603-RES]
R7  330  RESISTOR0603-RES  [0603-RES]
R12  100k  RESISTOR0402  [0402]
R13  10k  RESISTOR0402  [0402]
R14  330  RESISTOR0603-RES  [0603-RES]
R15  330  RESISTOR0603-RES  [0603-RES]
R16  330  RESISTOR0603-RES  [0603-RES]
R17  330  RESISTOR0603-RES  [0603-RES]
R18  330  RESISTOR0603-RES  [0603-RES]
R20  330  RESISTOR0603-RES  [0603-RES]
R22  330  RESISTOR0603-RES  [0603-RES]
R23  330  RESISTOR0603-RES  [0603-RES]
R24  330  RESISTOR0603-RES  [0603-RES]
R25  330  RESISTOR0603-RES  [0603-RES]
R28  330  RESISTOR0603-RES  [0603-RES]
R30  330  RESISTOR0603-RES  [0603-RES]
R31  330  RESISTOR0603-RES  [0603-RES]
TVS1  TVS_DIODE_SOD-923  [SOD-923]
TVS2  TVS_DIODE_SOD-923  [SOD-923]
U$22  COMMONMODEFILTER2014  [2014]
U$27  6P6C  [6P6C]
U$42  TSRN1  [TSRN1]
U$44  5k  0.05OHM-1/5W-1%(0603)  [0603]
U$52  3k  0.05OHM-1/5W-1%(0603)  [0603]
X5  MSTBV8  [MSTBV8]
X8  MSTBV8  [MSTBV8]

### Nets
3.3V: JP2.2
5V: JP2.12 R13.2
+12V: C51.1 JP2.15 L1.P$1 U$42.P$1(P1) U$44.1 ; supply symbol labelled 12V ; also sheet 1,2
-9V: C53.2 D4.C L2.P$2 ; also sheet 1,2
ADCCS: R20.1 ; also sheet 2
ARDUINORESET: C92.1 JP1.3 Q5.3(D) R13.1
CLR: R7.1 ; also sheet 1
D1: X5.1 ; also sheet 1
D2: X5.3 ; also sheet 1
D3: X5.5 ; also sheet 1
D4: X5.7 ; also sheet 1
D5: X8.1 ; also sheet 1
D6: X8.3 ; also sheet 1
D7: X8.5 ; also sheet 1
D8: X8.7 ; also sheet 1
D13: JP1.15 R1.2
D14: JP1.14 R5.2
D15: JP1.13 R6.2
D16: JP1.12 R7.2
D17: JP1.11 R14.2
D18: JP1.10 R15.2
D19: JP1.9 R16.2
D20: JP1.8 R17.2
D21: JP1.7 R18.2
D23: JP1.5 R20.2
DAC1: R14.1 ; also sheet 1
DAC2: R15.1 ; also sheet 1
DAC3: R16.1 ; also sheet 1
DAC4: R17.1 ; also sheet 1
E: R28.1 ; also sheet 2
EN: R18.1 ; also sheet 2
GND: C49.- C50.2 C51.2 C52.1 C53.1 C92.2 D1.C D2.P$1 JP1.4 JP2.14 Q5.2(S) R12.2 TVS1.P$2 TVS2.P$2 U$22.P$3 U$42.P$3(P3) U$52.1 X5.2 X5.4 X5.6 X5.8 X8.2 X8.4 X8.6 X8.8 ; also sheet 1,2
LDAC: R6.1 ; also sheet 1
MISO: R5.1 ; also sheet 2
MOSI: R1.1 ; also sheet 1,2
N$4: JP2.7 R28.2
N$6: JP2.9 R30.2
N$9: JP2.1 R22.2
N$10: JP2.8 R31.2
N$11: JP2.4 R23.2
N$12: D1.A U$44.2
N$20: JP2.5 R24.2
N$23: JP2.6 R25.2
N$32: C49.+ C50.1 L1.P$2 L3.P$1
N$34: C52.2 L2.P$1 U$42.P$2(P2)
N$35: L3.P$2 U$22.P$2
N$36: D14.C U$22.P$1
N$63: F2.2 U$27.6
N$107: D4.A U$52.2
POW-: U$22.P$4 U$27.3 U$27.4
RESET: Q5.1(G) R12.1 U$27.5
S0: R23.1 ; also sheet 2
S1: R24.1 ; also sheet 2
S2: R25.1 ; also sheet 2
SCL: R30.1 TVS2.P$1 U$27.1
SCLK: R22.1 ; also sheet 1,2
SDA: R31.1 TVS1.P$1 U$27.2
VPOS: D2.P$2 D14.A F2.1
Unconnected: JP1.1 JP1.2 JP1.6 JP2.3 JP2.10 JP2.11 JP2.13

## Library data of the parts
C1 C2 C4 C6 C7_1-C7_4 C8 C14 C17 C19 C20 C22 C24 C28 C34 C37 C41 C43 C107 C108 C_VCC_INA_1-C_VCC_INA_20 = SparkFun:CAP: Capacitor Standard 0603 ceramic capacitor, and 0.1" leaded capacitor.
C3 C5 C7 C9-C13 C15 C16 C18 C21 C23 C25-C27 C29-C33 C35 C36 C38-C40 C42 C44-C48 C50-C53 C92-C95 C97 C101-C106 C110 C111 C142 C143 C146 C147 C204 C224-C226 C228 = microbuilder:CAP_CERAMIC: Ceramic Capacitors 0402 - 0402 Surface Mount Capacitors 16pF 50V 5% [Digikey: 445-4899-2-ND] 18pF 50V 5% [Digikey: 490-1281-2-ND] 22pF 50V 5% [Digikey: 490-1283-2-ND] 68pF 50V 5% [Digikey: 490-1289-2-ND] 0.1uF 10V 10% [Digikey: 490-1318-2-ND] 1.0uF 6.3V 10% [Digikey: 490-1320-2-ND] 0603 - 0603 Surface Mount Capacitors 16 pF 50V 5% [Digikey: 445-5051-2-ND] 22 pF 50V [Digikey: PCC220ACVTR-ND] 33 pF 50V 5% [Digikey: 490-1415-1-ND] 56pF 50V 5% [Digikey: 490-1421-1-ND] 220pF 50V 5% [Digikey: 445-1285-1-ND] 680 pF 50V 2200 pF 50V 5% C0G [Digikey: 445-1297-1-ND] 5600 pF 100V 5% X7R [Digikey: 478-3711-1-ND] 0.1 µF 25V 10% [Digikey: PCC2277TR-ND] 0.22 µF 16V 10% X7R [Digikey: 445-1318-1-ND] 1.0 µF 25V 10% [Digikey: 445-5146-2-ND] 0603 - RF Specific 3pF 250V +/-0.1pF RF [Digikey: 712-1347-1-ND] 18 pF 250V 5% [Digikey: 478-3505-1-ND or 712-1322-1-ND] 56 pF 250V 5% C0G RF [Digikey: 490-4867-1-ND] 68 pF 250V RF [Digikey: 490-4868-1-ND] 0805 - 0805 Surface Mount Capacitors 220 pF 250V 2% RF Ceramic Capacitor [Digikey: 712-1398-1-ND] 1000 pF 50V 2% NP0 Ceramic Capacitor [Digikey: 478-3760-1-ND] 0.1 µF 25V 10% Ceramic Capacitor [Digikey: PCC1828TR-ND] 1.0 µF 16V 10% Ceramic Capacitor[Digikey: 490-1691-2-ND] 10.0 µF 10V 10% Ceramic Capacitor[Digikey: 709-1228-1-ND] 10.0 uF 16V 10% Ceramic Capacitor [Digikey: 478-5165-2-ND] 47 uF 6.3V 20% Ceramic Capacitor [Digikey: 587-1779-1-ND or 399-5506-1-ND] 1206 - 1206 Surface Mount Capacitors 47uF 10V 20% Ceramic Capacitor [Digikey: 490-5528-1-ND or 399-5508-1-ND or 445-6010-1-ND] 100uF 6.3V -20%, +80% Y5V Ceramic Capacitor (Digikey: 490-4512-1-ND, Mouser: 81-GRM31CF50J107ZE1L)
C7_13 C7_14 C210 C211 = SparkFun-Passives:CAP: Capacitor Standard 0603 ceramic capacitor, and 0.1" leaded capacitor.
C49 = SparkFun-Capacitors:CAP_POL: Capacitor Polarized These are standard SMD and PTH capacitors. Normally 10uF, 47uF, and 100uF in electrolytic and tantalum varieties. Always verify the external diameter of the through hole cap, it varies with capacity, voltage, and manufacturer. The EIA devices should be standard.
CF1-CF8 = murata-filter:NFM: EMIFIL(R) (Capacitor type) Single Circuit Type for Signal Lines Source: http://search.murata.co.jp/Ceramy/image/img/PDF/ENG/L0111S0109NFM3DC.pdf; MPN: NFM21CC102R1H3D; OC_FARNELL: 1828795; OC_NEWARK: 84R0165
D1 = SparkFun-LED:LED-RED: Assorted Red LEDs LilyPad 1206- DIO-09912 1206- DIO-00809 0603- DIO-00819 "SMART" means more efficient and expensive; PROD_ID: DIO-09912
D2 TVS1-TVS10 = passives:TVS_DIODE
D4 = SparkFun-LED:LED-RED: Assorted Red LEDs LilyPad 1206- DIO-09912 1206- DIO-00809 0603- DIO-00819 "SMART" means more efficient and expensive; PROD_ID: DIO-09912; VALUE: RED
D14 = SparkFun-DiscreteSemi:DIODE-SCHOTTKY: Schottky diodes in SFE's production catalog BAT20J 1A 23V 0.62Vf RB751 120mA 40V 0.37Vf PMEG4005EJ 0.5A 40V 0.42Vf MBRA140 1A 40V 0.5Vf B340A 3A 40V SMA; PROD_ID: DIO-08053
F2 = SparkFun:PTC: Resettable Fuse PTC Resettable Fuse. Spark Fun Electronics SKU : COM-08357
IC1-IC4 IC6-IC9 = burr-brown:OPA2130: Operational Amplifier; MF: TEXAS INSTRUMENTS; MPN: OPA2130UA; OC_FARNELL: 1459554; OC_NEWARK: 35C1841
IC5 = linear:OPA422*: High Precision, Low Noise OPERATIONAL AMPLIFIERS Source: http://focus.ti.com/lit/ds/symlink/opa227.pdf
JP1 JP2 = SparkFun-Connectors:M15: Header 15 Standard 15-pin 0.1" header. Use with straight break away headers (SKU : PRT-00116), right angle break away headers (PRT-00553), swiss pins (PRT-00743), machine pins (PRT-00117), and female headers (PRT-00115).
L1-L3 = SparkFun-Passives:INDUCTOR: Inductors Basic Inductor/Choke - 0603 and 1206. Footprints are not proven and vary greatly between part numbers. INDUCTOR POWER 3.3UH 4.0A SMD 0.197" L x 0.197" W x 0.177" H (5.00mm x 5.00mm x 4.50mm)
Q5 = SparkFun-DiscreteSemi:MOSFET-NCHANNEL: Common NMOSFET Parts MFG P/N Store ID Prod ID FDD8780 TRANS-09984 SI7820DN TRANS-11055 FDS6630A IC-08089 2N7002PW TRANS-11151 FQP30N06L COM-10213 TRANS-10060 BSS123LT1G TRANS-08345 BSS138 TRANS-00830 BS170 2N7000; PROD_ID: TRAN-12988
R1 R1_25-R1_28 R5-R11 R14-R18 R20-R25 R28 R30 R31 R51 R52 R98-R101 = SparkFun-Passives:RESISTOR: Resistor
R1_1-R1_16 = SparkFun:RESISTOR: Resistor
R2-R4 R32 R88 = SparkFun-Resistors:0.27OHM-1/10W-1%(0603): RES-08787
R12 R13 = microbuilder:RESISTOR: Resistors 0402 - 0402 Surface Mount Package 22 Ohm 1% 1/16W [Digikey: 311-22.0LRTR-ND] 33 Ohm 5% 1/16W 1.0K 5% 1/16W 1.5K 5% 1/16W 2.0K 1% 1/16W 10.0K 1% 1/16W [Digikey: 311-10.0KLRTR-ND] 10.0K 5% 1/16W [Digikey: RMCF0402JT10K0TR-ND] 12.1K 1% 1/16W [Digikey: 311-22.0LRTR-ND] 100.0K 5% 1/16W 0603 - 0603 Surface Mount Package 0 Ohm 1/10 Watt 1% Resistor 15 Ohm 1/10 Watt 1% Resistor 33 Ohm 1/10 Watt 1% Resistor 49.9 Ohm 1/10 Watt 1% Resistor 100 Ohm 1/10 Watt 1% Resistor 150 Ohm 1/10 Watt 1% Resistor 240 Ohm 1/10 Watt 1% Resistor 390 Ohm 1/10 Watt 1% Resistor 560 Ohm 1/10 Watt 1% Resistor 680 Ohm 1/10 Watt 1% Resistor 750 Ohm 1/10 Watt 1% Resistor 1.0K Ohm 1/10 Watt 1% Resistor 1.5K Ohm 1/10 Watt 1% Resistor 2.0K Ohm 1/10 Watt 1% Resistor 2.2K Ohm 1/10 Watt 1% Resistor 3.3K Ohm 1/10 Watt 1% Resistor 4.7K Ohm 1/10 Watt 1% Resistor 10.0K Ohm 1/10 Watt 1% Resistor 12.0K Ohm 1/10 Watt 1% Resistor 12.1K Ohm 1/10 Watt 1% Resistor 20.0K Ohm 1/10 Watt 1% Resistor 33.0K Ohm 1/10 Watt 1% Resistor 100.0K Ohm 1/10 Watt 1% Resistor 0805 - 0805 Surface Mount Package 0 Ohm 1/8 Watt 1% Resistor 33 Ohm 1/8 Watt 1% Resistor 100 Ohm 1/8 Watt 1% Resistor 150 Ohm 1/8 Watt 1% Resistor 200 Ohm 1/8 Watt 1% Resistor 240 Ohm 1/8 Watt 1% Resistor 330 Ohm 1/8 Watt 1% Resistor 390 Ohm 1/8 Watt 1% Resistor 470 Ohm 1/8 Watt 1% Resistor 1.0K Ohm 1/8 Watt 1% Resistor 1.5K Ohm 1/8 Watt 1% Resistor 2.0K Ohm 1/8 Watt 1% Resistor 4.7K Ohm 1/8 Watt 1% Resistor 5.1K Ohm 1/8 Watt 1% Resistor 5.6K Ohm 1/8 Watt 1% Resistor 10.0K Ohm 1/8 Watt 1% Resistor 22.0K Ohm 1/8 Watt 1% Resistor 33.0K Ohm 1/8 Watt 1% Resistor 100K Ohm 1/8 Watt 1% Resistor 1206 - 1206 Surface Mount Package 2012 - 2010 Surface Mount Package 0.11 Ohm 1/2 Watt 1% Resistor - Digikey: RHM.11UCT-ND
REF1-REF4 REF7 = texas:REF3020
U$1 U$2 U$5 U$9 U$14 U$15 U$20 U$21 = texas:INA285
U$3 U$10 U$16 U$23 U$58 = texas:INA2132
U$4 U$11 U$17 U$24 = texas:DAC7563
U$6 U$57 = texas:CD54HC4051
U$7 U$8 U$12 U$13 U$18 U$19 U$25 U$26 = murata-filter:CLC
U$22 = murata-filter:COMMONMODEFILTER
U$27 = rj:6P6C
U$39 = texas:LMP2021
U$40 = texas:ADS1018
U$42 = dc-dc-converter:TSRN1
U$44 U$52 = SparkFun-Resistors:0.05OHM-1/5W-1%(0603); PROD_ID: RES-12535
U$48 U$49 = texas:TPS7A30
X5 X8 = con-phoenix-500:MSTBV8: PHOENIX; OC_FARNELL: unknown; OC_NEWARK: unknown